# Altium schematic sheet power_supply.SchDoc
size A4
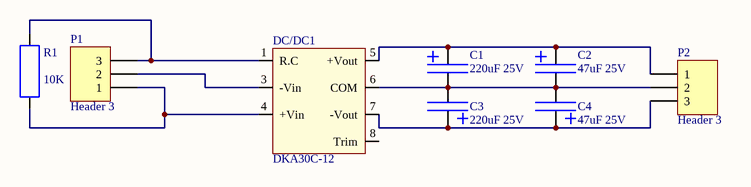
[diagram p0: power_supply.SchDoc]

## Parts
C1  220uF 25V  [Cond 6mm 25V]
C2  47uF 25V  [Cond 6mm 25V]
C3  220uF 25V  [Cond 6mm 25V]
C4  47uF 25V  [Cond 6mm 25V]
DC/DC1  DKA30C-12  [MW_DKA30C-12]
P1  Header 3  [HDR1X3]
P2  Header 3  [HDR1X3]
R1  10K  [R0805]

## Nets
NetC1_1: C1.1 C2.1 DC/DC1.5(+Vout) P2.1
NetC1_2: C1.2 C2.2 C3.2 C4.2 DC/DC1.6(COM) P2.2
NetC3_1: C3.1 C4.1 DC/DC1.7(-Vout) P2.3
NetDC/DC1_1: DC/DC1.1(R.C) P1.3 R1.2
NetDC/DC1_3: DC/DC1.3(-Vin) P1.2
NetDC/DC1_4: DC/DC1.4(+Vin) P1.1 R1.1

Not connected (* = marked no-connect by the designer): DC/DC1 8(Trim)

## Library data of the parts
C1-C4 = Cond_polar
DC/DC1 = MW_DKA30C-12
P1 P2 = Header 3: Header, 3-Pin; LatestRevisionDate: 17-Jul-2002; LatestRevisionNote: Re-released for DXP Platform.; Publisher: Altium Limited
R1 = Resistor